# EAGLE schematic pomiary (EAGLE 6.6.0)
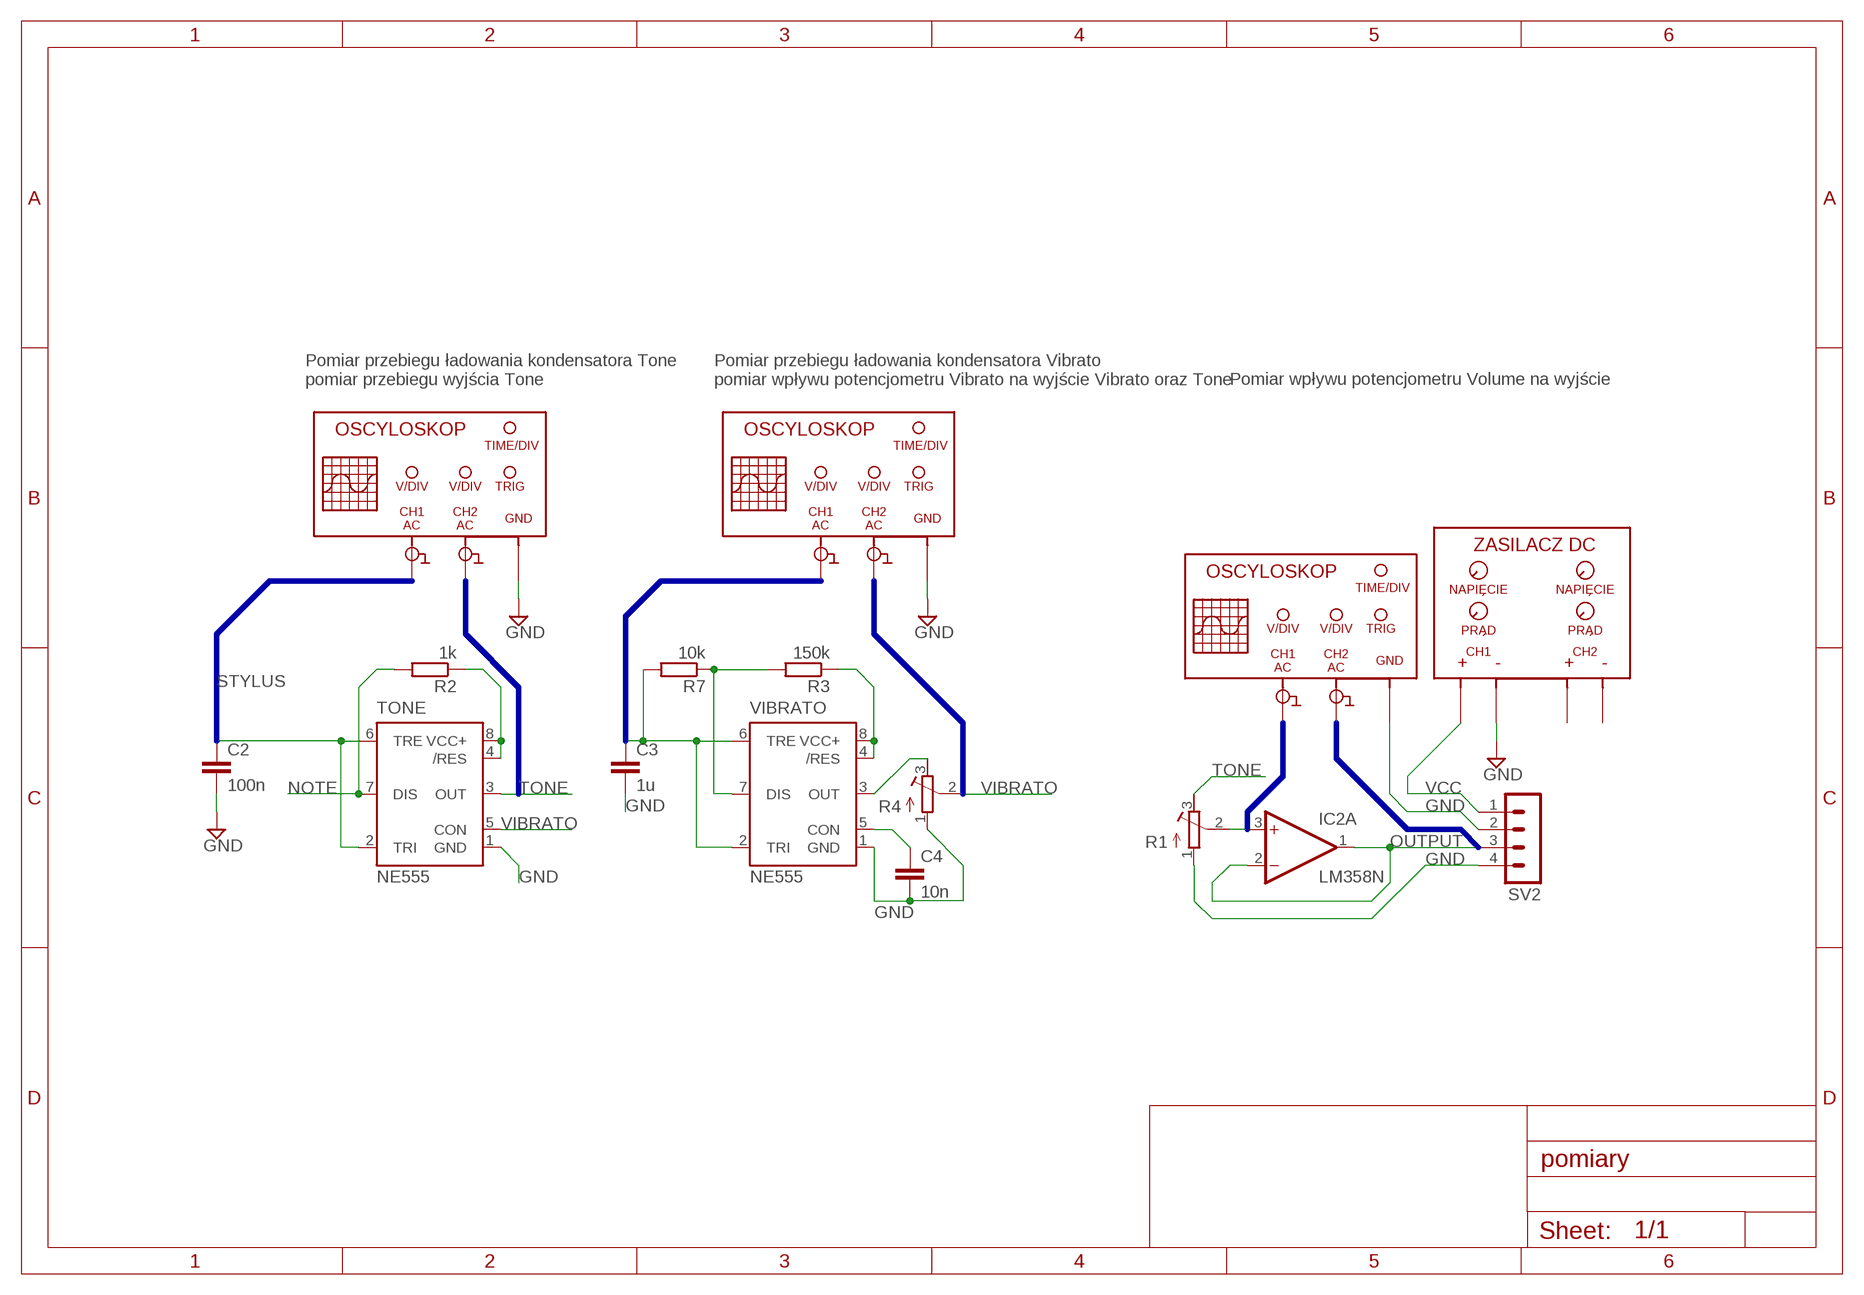
[diagram p0: schematic, sheet 1]

## Parts
C2  100n  C2.5/5  [C2.5-5]
C3  1u  C2.5/5  [C2.5-5]
C4  10n  C2.5/5  [C2.5-5]
IC2  LM358N  [DIL08]
R1  R-TRIMM5X  [RTRIM5X]
R2  1k  R-EU_M1206  [M1206]
R3  150k  R-EU_M1206  [M1206]
R4  R-TRIMM5X  [RTRIM5X]
R7  10k  R-EU_0204/7  [0204/7]
SV2  MA04-1  [MA04-1]
TONE  NE555  [DIL-08]
U$1  ZASILACZ  [ZASILACZ]
U$2  OSCYLOSKOP_AC_AC  [OSCYLOSKOP]
U$3  OSCYLOSKOP_AC_AC  [OSCYLOSKOP]
U$4  OSCYLOSKOP_AC_AC  [OSCYLOSKOP]
VIBRATO  NE555  [DIL-08]

## Nets
GND: C2.2 C3.2 C4.2 R1.1(E) R4.1(E) SV2.2 SV2.4 TONE.1(GND) U$1.C1-(CH1-) U$2.GND U$3.GND U$4.GND VIBRATO.1(GND)
N$1: C4.1 VIBRATO.5(CON)
N$2: IC2.3(A:+IN) R1.2(S)
N$3: R3.2 R7.1 VIBRATO.7(DIS)
N$4: R4.3(A) VIBRATO.3(OUT)
NOTE: R2.2 TONE.7(DIS)
NOTSTYLUS: C3.1 R7.2 VIBRATO.2(TRI) VIBRATO.6(TRE)
OUTPUT: IC2.1(A:OUT) IC2.2(A:-IN) SV2.3
STYLUS: C2.1 TONE.2(TRI) TONE.6(TRE)
TONE: R1.3(A) TONE.3(OUT)
VCC: R2.1 R3.1 SV2.1 TONE.4(/RES) TONE.8(VCC+) U$1.C1+(CH1+) VIBRATO.4(/RES) VIBRATO.8(VCC+)
VIBRATO: R4.2(S) TONE.5(CON)
Unconnected: IC2.5(B:+IN) IC2.6(B:-IN) IC2.7(B:OUT) U$1.C2+(CH2+) U$1.C2-(CH2-) U$2.CH1 U$2.CH2 U$3.CH1 U$3.CH2 U$4.CH1 U$4.CH2

## Buses
B$1
B$2
B$3
B$4
B$5
B$6

## Notes on the sheet
- Pomiar przebiegu ładowania kondensatora Tone
  pomiar przebiegu wyjścia Tone
- Pomiar przebiegu ładowania kondensatora Vibrato
  pomiar wpływu potencjometru Vibrato na wyjście Vibrato oraz Tone
- Pomiar wpływu potencjometru Volume na wyjście

## Power pins joined to a net without a drawn wire
V+: IC2.8(P:V+)
V-: IC2.4(P:V-)

## Library data of the parts
C2-C4 = capacitor-wima:C: CAPACITOR naming: grid - package width
IC2 = linear:LM358: OP AMP also LM158; LM258; LM2904 Source: http://cache.national.com/ds/LM/LM158.pdf
R1 R4 = resistor:R-TRIMM: Trimm resistor
R2 R3 R7 = resistor:R-EU_: RESISTOR, European symbol
SV2 = con-lstb:MA04-1: PIN HEADER; OC_FARNELL: unknown; OC_NEWARK: unknown
TONE VIBRATO = st-microelectronics:NE555: General purpose bipolar Timer; MF: Arrow Electronics; MPN: NE555N; OC_FARNELL: 1467742; OC_NEWARK: 89K1486
U$1 = Przyrzady pomiarowe:ZASILACZ
U$2-U$4 = Przyrzady pomiarowe:OSCYLOSKOP_AC_AC